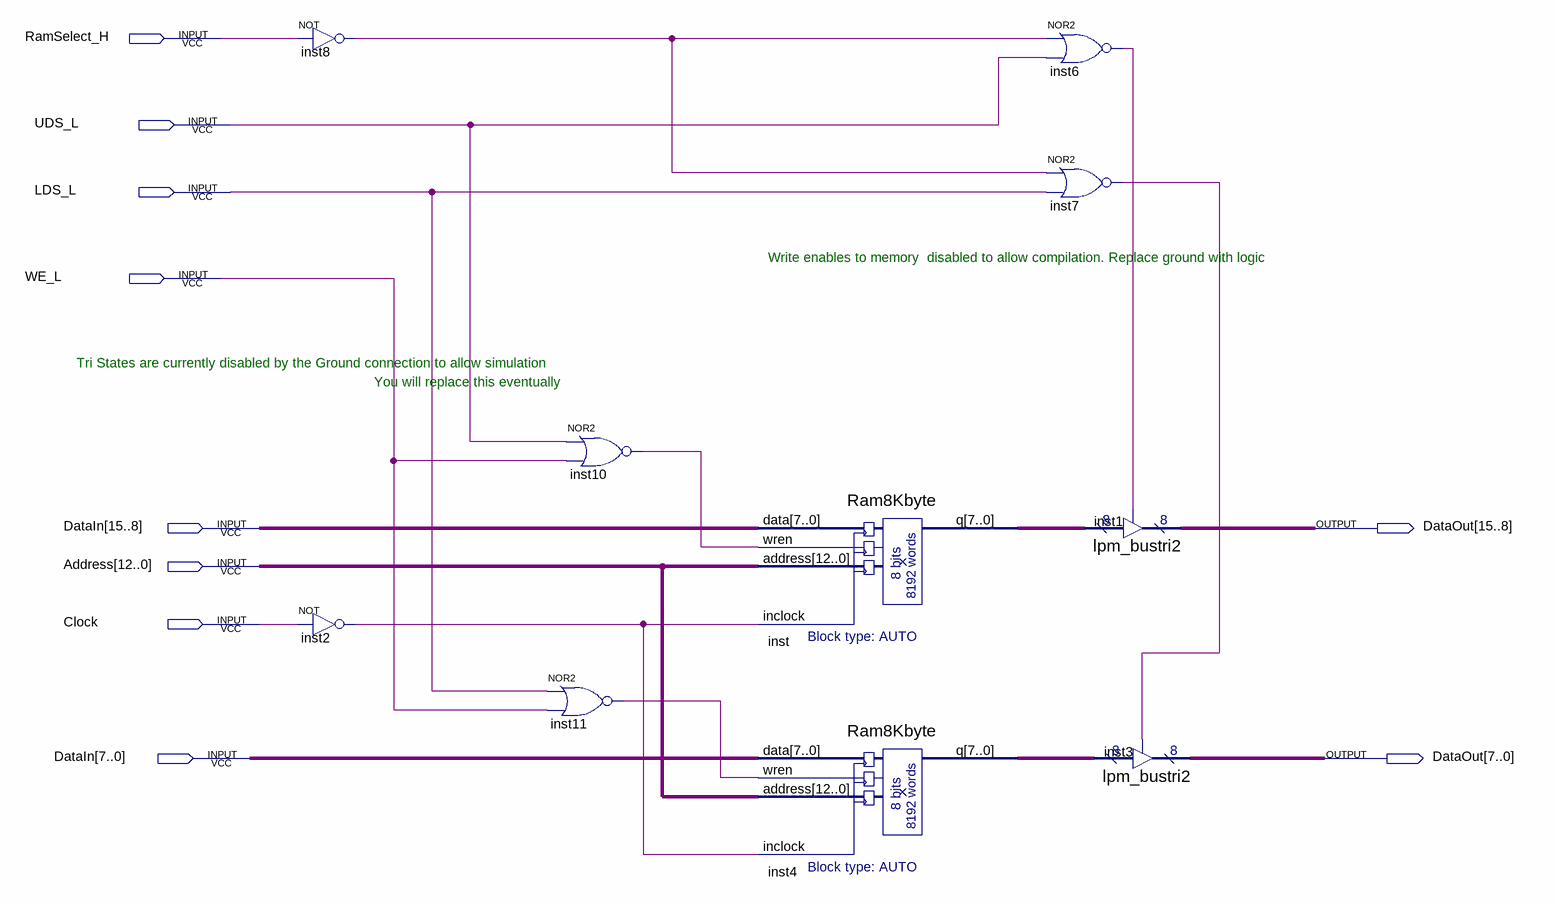
[diagram p0: schematic sheet]
// Quartus schematic OnChip16KbyteRam.bdf as structural Verilog: 10 symbols, 10 pins
module OnChip16KbyteRam (
  input  RamSelect_H,
  input  UDS_L,
  input  LDS_L,
  input  WE_L,
  input  [15:0] DataIn,
  input  [12:0] Address,
  input  Clock,
  output [15:0] DataOut
);

  wire inst2_out, inst6_out, inst7_out, inst8_out, inst10_out, inst11_out;
  wire [7:0] inst4_q, inst_q;

  not inst8 (inst8_out, RamSelect_H);
  not inst2 (inst2_out, Clock);
  nor inst10 (inst10_out, UDS_L, WE_L);
  nor inst11 (inst11_out, LDS_L, WE_L);
  Ram8Kbyte inst (.data(DataIn[15:8]), .wren(inst10_out), .address(Address), .inclock(inst2_out), .q(inst_q));
  Ram8Kbyte inst4 (.data(DataIn[7:0]), .wren(inst11_out), .address(Address), .inclock(inst2_out), .q(inst4_q));
  nor inst6 (inst6_out, inst8_out, UDS_L);
  nor inst7 (inst7_out, inst8_out, LDS_L);
  lpm_bustri2 inst1 (.enabledt(inst6_out), .data(inst_q), .tridata(DataOut[15:8]));
  lpm_bustri2 inst3 (.enabledt(inst7_out), .data(inst4_q), .tridata(DataOut[7:0]));

  // Notes on the sheet:
  //   Write enables to memory  disabled to allow compilation. Replace ground with logic
  //   Tri States are currently disabled by the Ground connection to allow simulation
  //   You will replace this eventually
endmodule
